# Altium project SCHEMA_PCB_GAMESTATION.PrjPcb
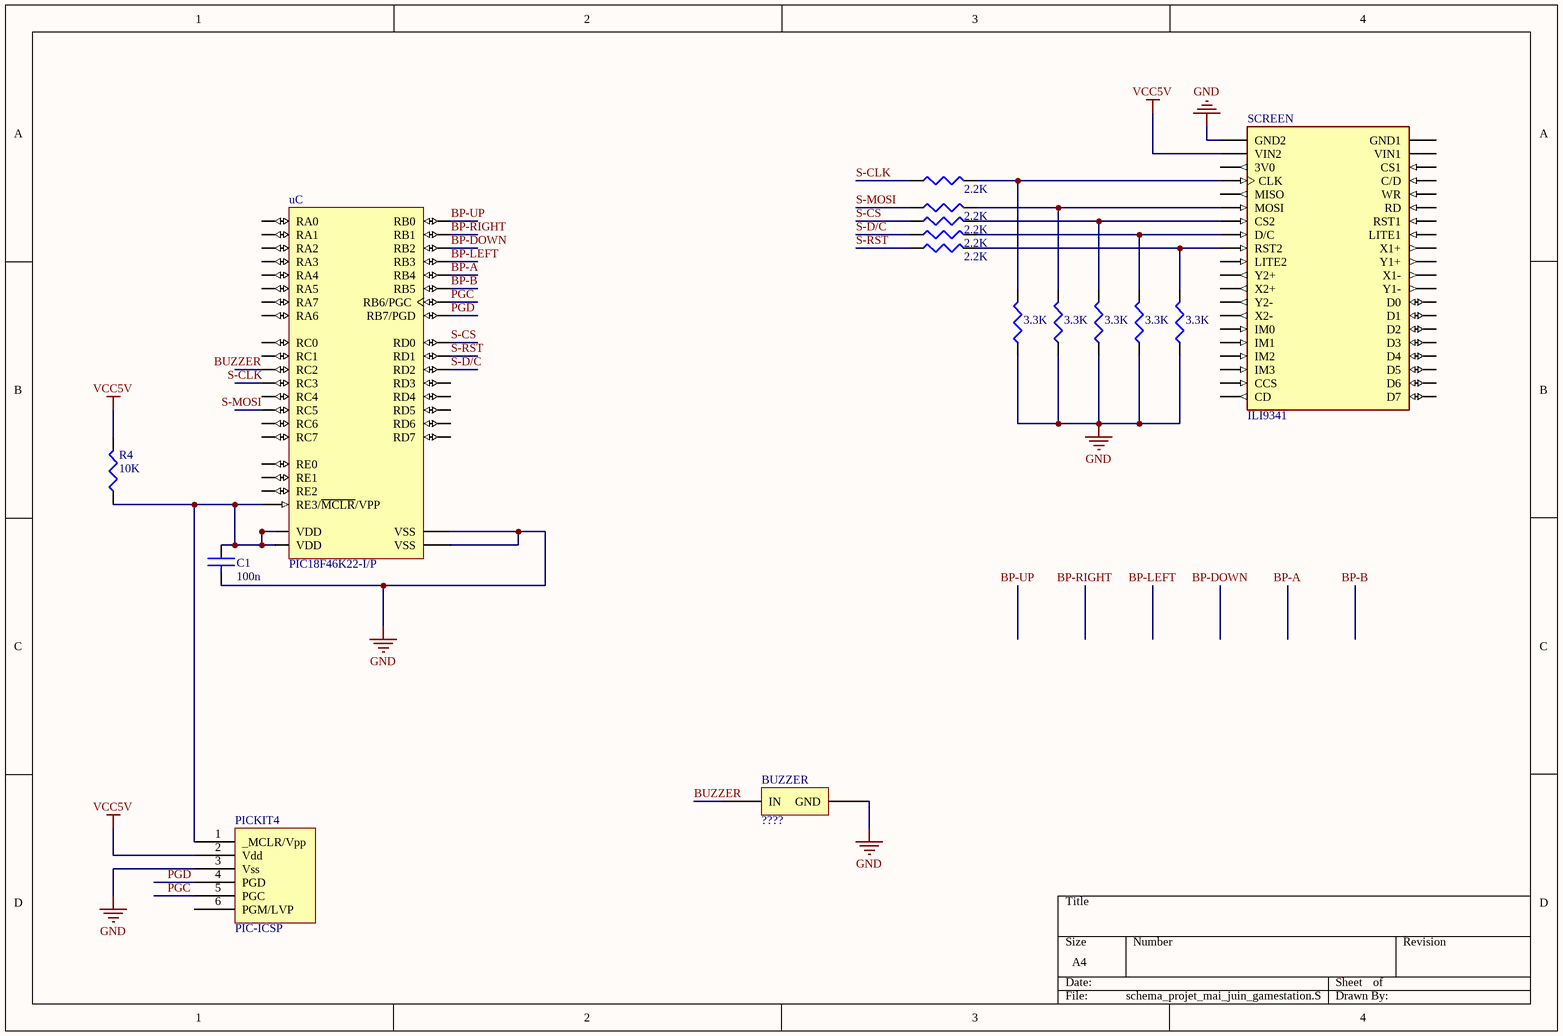
[diagram p0: schema_projet_mai_juin_gamestation.SchDoc]
1 sheet, 16 parts. Net scope: global (net labels, ports and power ports of the same name join across sheets).

## Sheet schema_projet_mai_juin_gamestation.SchDoc
size A4; SheetNumber: 1; SheetTotal: 1

### Parts
(Parts that share a designator on the sheet are numbered #1, #2 ... from top to bottom, then left to right.)
BUZZER  ????  [BUZZER]
C1  value 100n  [0402]  (hidden comment: CAP)
PICKIT4  PIC-ICSP  [PIC-ICSP]
R4  value 10K  [0201]  (hidden comment: RES)
R7  value 3.3K  [0201]  (hidden comment: RES)
R8  value 3.3K  [0201]  (hidden comment: RES)
R9  value 3.3K  [0201]  (hidden comment: RES)
R10  value 3.3K  [0201]  (hidden comment: RES)
R11  value 3.3K  [0201]  (hidden comment: RES)
R?#1  value 2.2K  [0201]  (hidden comment: RES)
R?#2  value 2.2K  [0201]  (hidden comment: RES)
R?#3  value 2.2K  [0201]  (hidden comment: RES)
R?#4  value 2.2K  [0201]  (hidden comment: RES)
R?#5  value 2.2K  [0201]  (hidden comment: RES)
SCREEN  ILI9341  [ADAFRUIT_2478]
uC  PIC18F46K22-I/P  [MCHP-PDIP-P40]

### Nets
GND: BUZZER.2(GND) C1.2 PICKIT4.3(Vss) R7.1 R8.1 R9.1 R10.1 R11.1 SCREEN.21(GND2) uC.12(VSS) uC.31(VSS)
VCC5V: PICKIT4.2(Vdd) R4.2 SCREEN.22(VIN2)
BP-A: uC.37(RB4)
BP-B: uC.38(RB5)
BP-DOWN: uC.35(RB2)
BP-LEFT: uC.36(RB3)
BP-RIGHT: uC.34(RB1)
BP-UP: uC.33(RB0)
BUZZER: BUZZER.1(IN)
PGC: PICKIT4.5(PGC) uC.39(RB6/PGC)
PGD: PICKIT4.4(PGD) uC.40(RB7/PGD)
S-CLK: R?#1.1
S-CS: R?#3.1 uC.19(RD0)
S-D/C: R?#4.1 uC.21(RD2)
S-MOSI: R?#2.1
S-RST: R?#5.1 uC.20(RD1)
NetC1_1: C1.1 PICKIT4.1(_MCLR/Vpp) R4.1 uC.1(RE3/~{MCLR}/VPP) uC.11(VDD) uC.32(VDD)
NetR7_2: R7.2 R?#1.2 SCREEN.24(CLK)
NetR8_2: R8.2 R?#2.2 SCREEN.26(MOSI)
NetR9_2: R9.2 R?#3.2 SCREEN.27(CS2)
NetR10_2: R10.2 R?#4.2 SCREEN.28(D/C)
NetR11_2: R11.2 R?#5.2 SCREEN.29(RST2)

Not connected (* = marked no-connect by the designer): PICKIT4 6(PGM/LVP); SCREEN 1(GND1) 2(VIN1) 3(CS1) 4(C/D) 5(WR) 6(RD) 7(RST1) 8(LITE1) 9(X1+) 10(Y1+) 11(X1-) 12(Y1-) 13(D0) 14(D1) 15(D2) 16(D3) 17(D4) 18(D5) 19(D6) 20(D7) 23(3V0) 25(MISO) 30(LITE2) 31(Y2+) 32(X2+) 33(Y2-) 34(X2-) 35(IM0) 36(IM1) 37(IM2) 38(IM3) 39(CCS) 40(CD); uC 2(RA0) 3(RA1) 4(RA2) 5(RA3) 6(RA4) 7(RA5) 8(RE0) 9(RE1) 10(RE2) 13(RA7) 14(RA6) 15(RC0) 16(RC1) 17(RC2) 18(RC3) 22(RD3) 23(RC4) 24(RC5) 25(RC6) 26(RC7) 27(RD4) 28(RD5) 29(RD6) 30(RD7)

### Notes on the sheet
- Labels drawn without touching a wire or pin:   BUZZER,   S-CLK, S-MOSI

### Library data of the parts
BUZZER = BUZZER
C1 = CAP: capacité non polarisée
R4 R7-R11 R?#1-R?#5 = RES: resistance
SCREEN = 2478: Resistive Graphic LCD Display Module Red, Green, Blue (RGB) TFT - Color Parallel, 8-Bit, SPI 2.4 (60.96mm) 240 x 320; MF: Adafruit Industries; Package: NON STANDARD Adafruit; Price: None; Value: *; SnapEDA_Link: https://www.snapeda.com/parts/2478/Adafruit+Industries+LLC/view-part/?ref=snap; MP: 2478; Availability: In Stock; Check_prices: https://www.snapeda.com/parts/2478/Adafruit+Industries+LLC/view-part/?ref=eda
uC = PIC18F46K22-I/P: Low-Power, High-Performance Microcontroller with XLP Technology, 64 MHz, 35 I/O, -40 to 85 degC, 40-pin PDIP (P40), Tube; Manufacturer: Microchip; # of A/D Channels: 28; Digital Communication: 2 -A/E/USART, 2 -MSSP(SPI/I2C); EEPROM Data Memory (bytes): 1024; I/O Pins: 35; Internal Oscillator: 16 MHz, 31 kHz; Max. CPU Speed MHz: 64; Memory Type: Flash; Operation Voltage Range: 2.3V - 5.5V; Program Memory KWords: 32; RAM: 3896; Timers: 3 - 8-bit, 4 - 16-bit; DatasheetVersion: Rev. F; PackageVersion: C04-016B, 04/2013; PackageReference: PDIP-P40; PackageDescription: 40-Lead Plastic Dual In-Line Package, Body 51.75 x 13.53 mm, Pitch 2.54 mm; Supplier 1: Digi-Key; Supplier Part Number 1: PIC18F46K22-I/P-ND; Supplier 2: Farnell; Supplier Part Number 2: 1814979; Supplier 3: Newark; Supplier Part Number 3: 65R6012; Supplier 4: Mouser; Supplier Part Number 4: 579-PIC18F46K22IP; Packing: TUBE; Program Memory KBytes: 64; RoHS: TRUE; Mounting Technology: Through Hole; PartNumber: PIC18F46K22-I/P; ComponentLink1Description: Datasheet; ComponentLink1URL: http://ww1.microchip.com/downloads/en/DeviceDoc/41412F.pdf; ComponentLink2Description: Package Specification; ComponentLink2URL: http://www.microchip.com/stellent/groups/techpub_sg/documents/packagingspec/en012702.pdf; ComponentLink3Description: URL Link1; ComponentLink3URL: Product URL:http://www.microchip.com/datasheet/PIC18F46K22